# EAGLE design H01R0 (EAGLE 9.6.1)

## Sheet 1 of 2
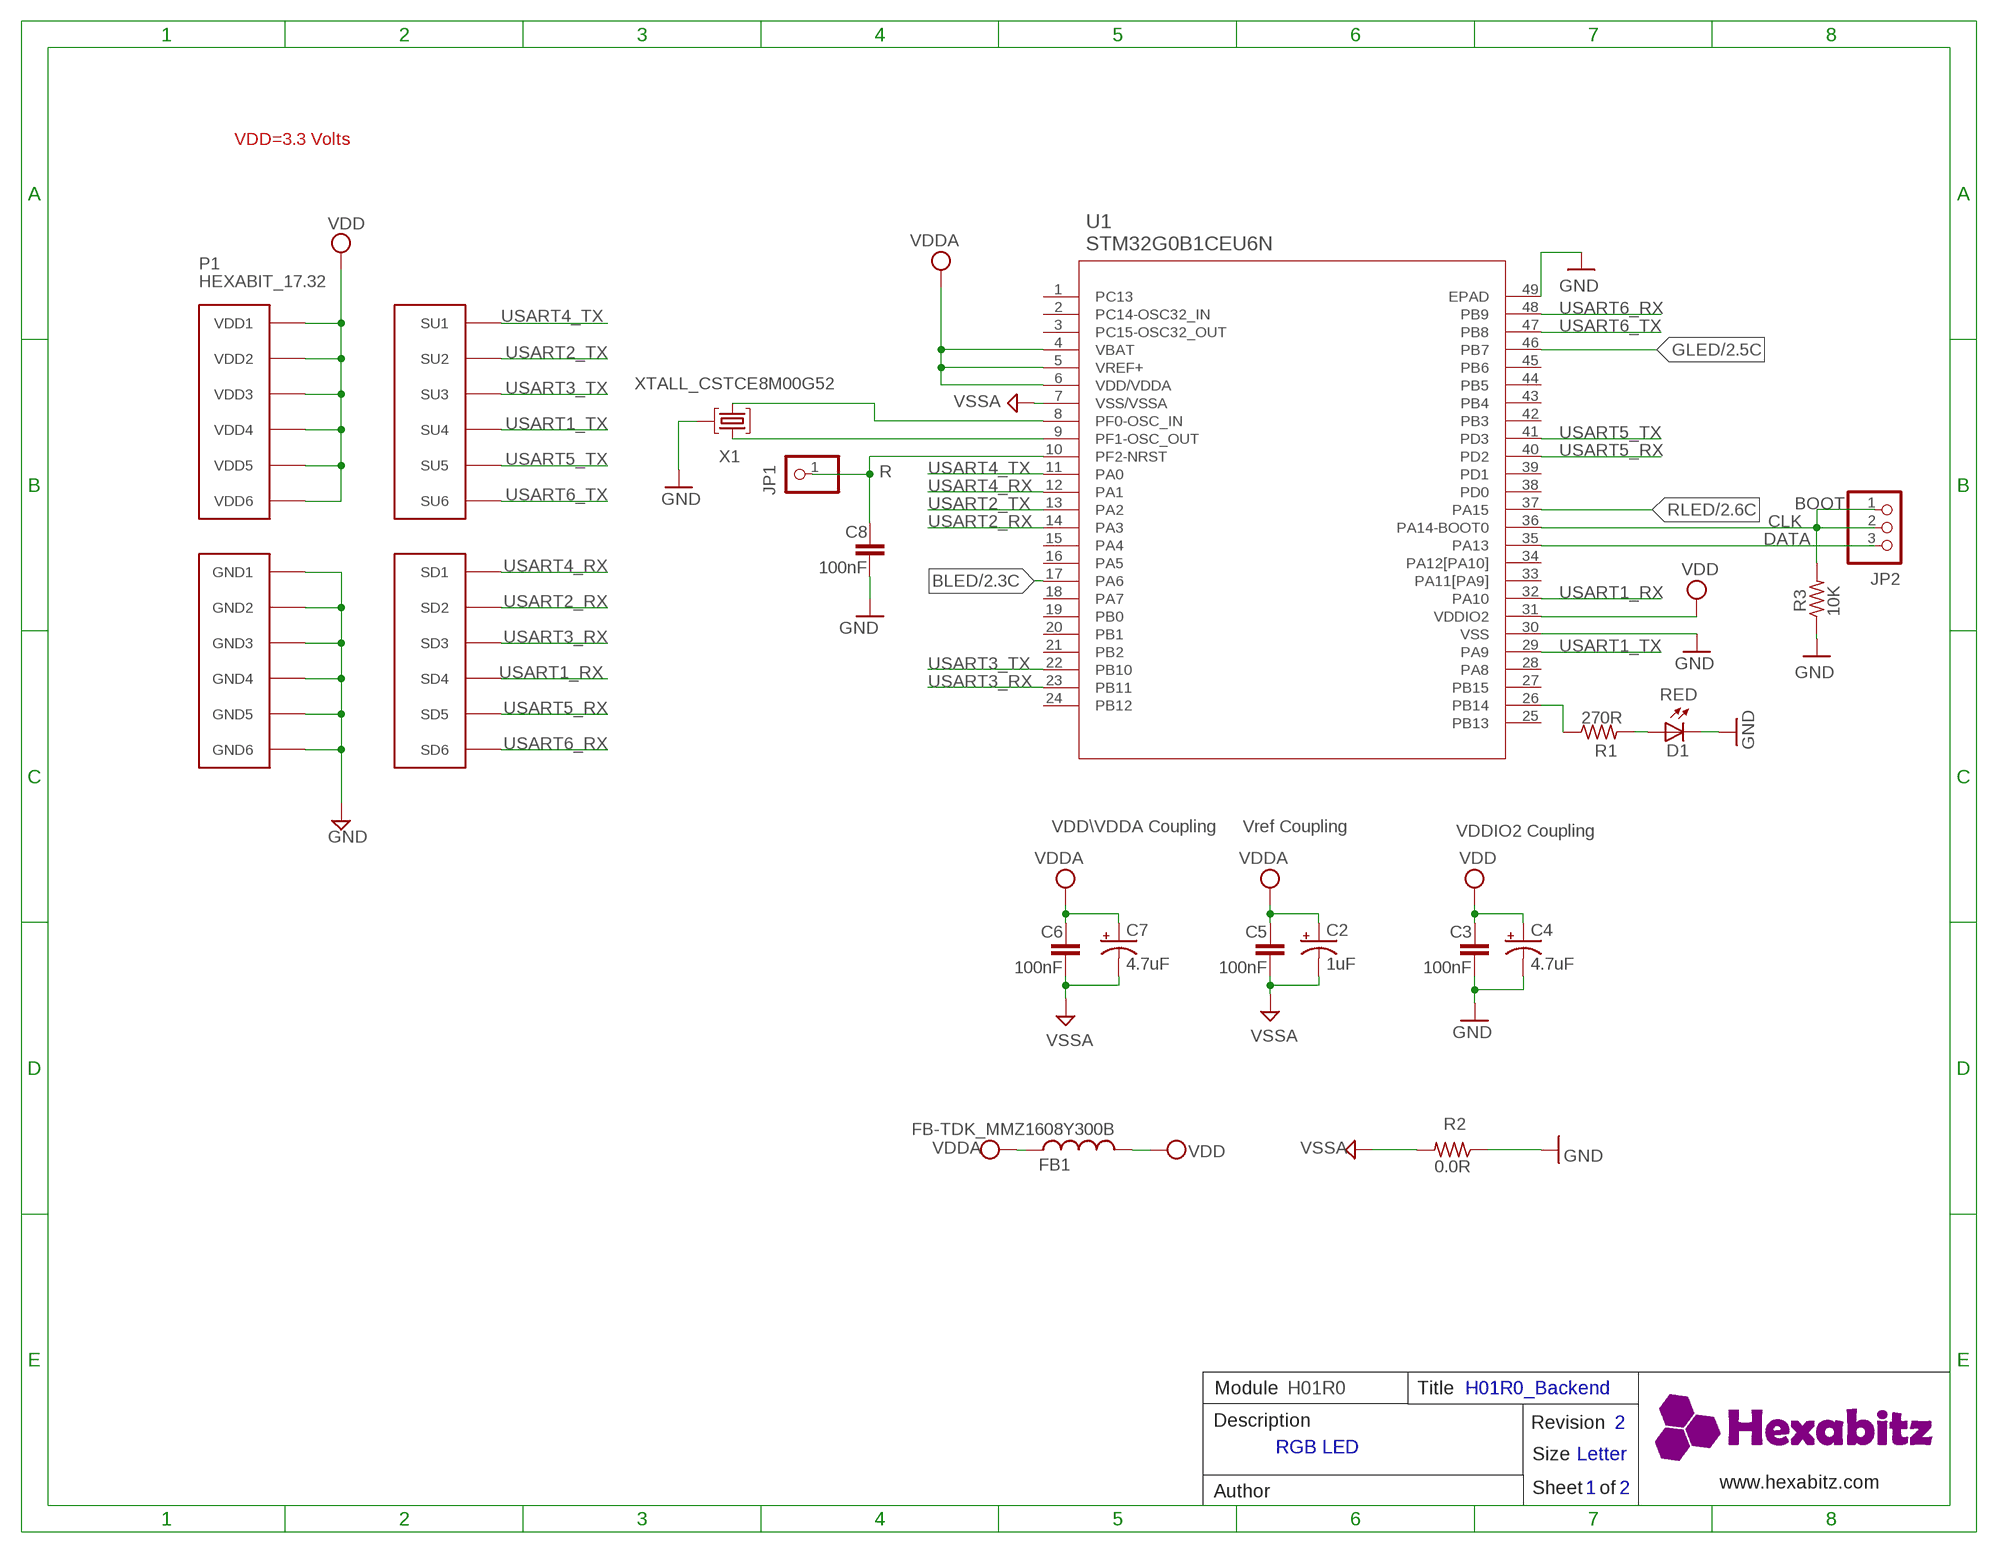
[diagram p0: schematic, sheet 1]

### Parts
C2  1uF  C-0805-POL  [C-0805-POL]
C3  100nF  C-0603  [C-0603]
C4  4.7uF  C-0805-POL  [C-0805-POL]
C5  100nF  C-0603  [C-0603]
C6  100nF  C-0603  [C-0603]
C7  4.7uF  C-0805-POL  [C-0805-POL]
C8  100nF  C-0603  [C-0603]
D1  RED  VLMS1300-GS08  [VLMS1300-GS08]
FB1  FB-TDK_MMZ1608Y300B  FB-0603  [FB-0603]
JP1  R  PINHD-1X1  [1X01]
JP2  PINHD-1X3  [1X03]
P1  HEXABIT_17.32  [HEXABIT_17.32]
R1  270R  R-0603  [R-0603]
R2  0.0R  R-0603  [R-0603]
R3  10K  R-0603  [R-0603]
U1  STM32G0B1CEU6N  [HEXABITZ_ICS_QFN_B1CEU6_STM-L]
X1  XTALL_CSTCE8M00G52  [XTALL_CSTCE8M00G52]

### Nets
BLED: U1.17(PA6) ; also sheet 2
CLK: JP2.1 JP2.2 R3.2 U1.36(PA14-BOOT0)
DATA: JP2.3 U1.35(PA13)
GLED: U1.46(PB7) ; also sheet 2
GND: C3.2 C4.2(-) C8.2 D1.C P1.PAD_PD7(GND1) P1.PAD_PD8(GND2) P1.PAD_PD9(GND3) P1.PAD_PD10(GND4) P1.PAD_PD11(GND5) P1.PAD_PD12(GND6) R2.1 R3.1 U1.30(VSS) U1.49(EPAD) X1.P$2 ; also sheet 2
N$3: D1.A R1.2
N$4: C8.1 JP1.1 U1.10(PF2-NRST)
N$5: U1.9(PF1-OSC_OUT) X1.P$1
N$6: U1.8(PF0-OSC_IN) X1.P$3
N$7: R1.1 U1.26(PB14)
RLED: U1.37(PA15) ; also sheet 2
USART1_RX: P1.PAD_PD4(SD4) U1.32(PA10)
USART1_TX: P1.PAD_PU4(SU4) U1.29(PA9)
USART2_RX: P1.PAD_PD2(SD2) U1.14(PA3)
USART2_TX: P1.PAD_PU2(SU2) U1.13(PA2)
USART3_RX: P1.PAD_PD3(SD3) U1.23(PB11)
USART3_TX: P1.PAD_PU3(SU3) U1.22(PB10)
USART4_RX: P1.PAD_PD1(SD1) U1.12(PA1)
USART4_TX: P1.PAD_PU1(SU1) U1.11(PA0)
USART5_RX: P1.PAD_PD5(SD5) U1.40(PD2)
USART5_TX: P1.PAD_PU5(SU5) U1.41(PD3)
USART6_RX: P1.PAD_PD6(SD6) U1.48(PB9)
USART6_TX: P1.PAD_PU6(SU6) U1.47(PB8)
VDD: C3.1 C4.1(+) FB1.2 P1.PAD_PU7(VDD1) P1.PAD_PU8(VDD2) P1.PAD_PU9(VDD3) P1.PAD_PU10(VDD4) P1.PAD_PU11(VDD5) P1.PAD_PU12(VDD6) U1.31(VDDIO2) ; also sheet 2
VDDA: C2.1(+) C5.1 C6.1 C7.1(+) FB1.1 U1.4(VBAT) U1.5(VREF+) U1.6(VDD/VDDA)
VSSA: C2.2(-) C5.2 C6.2 C7.2(-) R2.2 U1.7(VSS/VSSA)
Unconnected: U1.1(PC13) U1.2(PC14-OSC32_IN) U1.3(PC15-OSC32_OUT) U1.15(PA4) U1.16(PA5) U1.18(PA7) U1.19(PB0) U1.20(PB1) U1.21(PB2) U1.24(PB12) U1.25(PB13) U1.27(PB15) U1.28(PA8) U1.33(PA11[PA9]) U1.34(PA12[PA10]) U1.38(PD0) U1.39(PD1) U1.42(PB3) U1.43(PB4) U1.44(PB5) U1.45(PB6)

### Notes on the sheet
- VDD=3.3 Volts
- BOOT
- VDD\VDDA Coupling | Vref Coupling | VDDIO2 Coupling
- Module | H01R0 | Title | H01R0_Backend
- Description | Revision | 2
- RGB LED
- Size | Letter
- www.hexabitz.com
- Author | Sheet   of | 1 | 2
- C:/Users/Admin/Desktop/logodraft.bmp

## Sheet 2 of 2
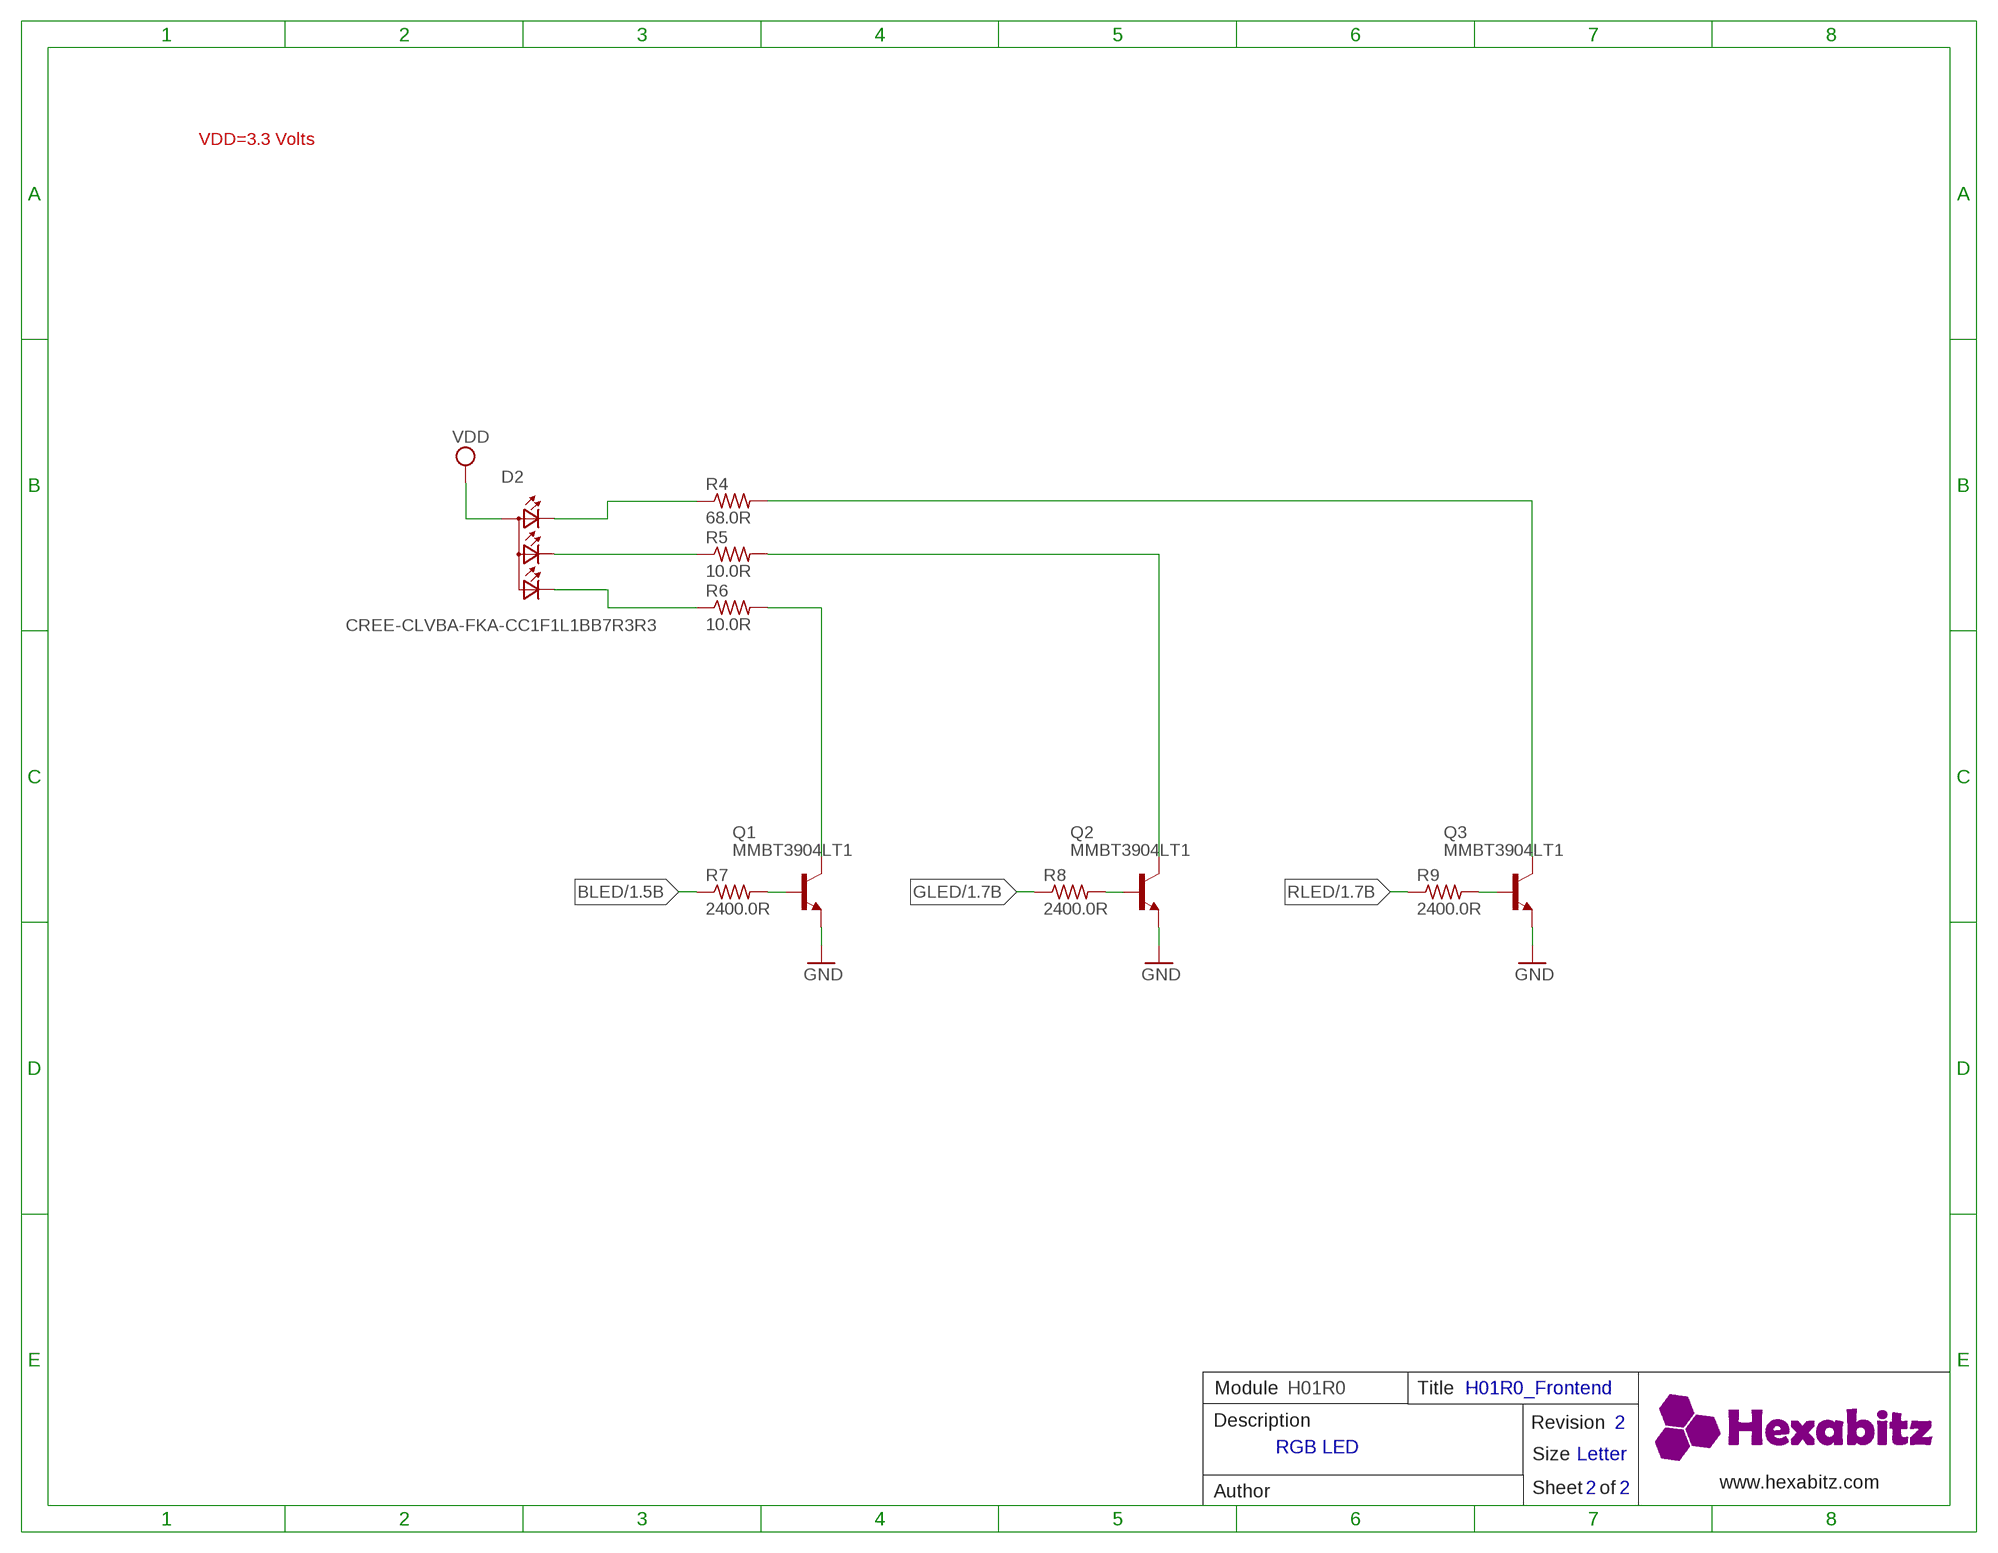
[diagram p1: schematic, sheet 2]

### Parts
D2  CREE-CLVBA-FKA-CC1F1L1BB7R3R3  [PCB-1023943-1]
Q1  MMBT3904LT1  [MMBT3904LT1]
Q2  MMBT3904LT1  [MMBT3904LT1]
Q3  MMBT3904LT1  [MMBT3904LT1]
R4  68.0R  R-0603  [R-0603]
R5  10.0R  R-0603  [R-0603]
R6  10.0R  R-0603  [R-0603]
R7  2400.0R  R-0603  [R-0603]
R8  2400.0R  R-0603  [R-0603]
R9  2400.0R  R-0603  [R-0603]

### Nets
BLED: R7.1 ; also sheet 1
GLED: R8.1 ; also sheet 1
GND: Q1.2(E) Q2.2(E) Q3.2(E) ; also sheet 1
N$1: D2.P$1(CRED) R4.1
N$2: D2.P$4(CGREEN) R5.1
N$8: D2.P$3(CBLUE) R6.1
N$10: Q1.3(C) R6.2
N$11: Q2.3(C) R5.2
N$12: Q3.3(C) R4.2
N$13: Q1.1(B) R7.2
N$14: Q2.1(B) R8.2
N$15: Q3.1(B) R9.2
RLED: R9.1 ; also sheet 1
VDD: D2.P$2(A2) ; also sheet 1

### Notes on the sheet
- VDD=3.3 Volts
- Module | H01R0 | Title | H01R0_Frontend
- Description | Revision | 2
- RGB LED
- Size | Letter
- www.hexabitz.com
- Author | Sheet   of | 2 | 2

## Library data of the parts
C2 C4 C7 = HEXABITZ_RCLS:C-0805-POL: Cap Tant Solid SMD 2012
C3 C5 C6 C8 = HEXABITZ_RCLS:C-0603: CAP CER 10% X7R 0603
D1 = Hexabitz:VLMS1300-GS08: Red 0603 130° Clear 54 mcd 2 V Surface Mount ChipLED ; Octopart Url : http://octopart.com/vlms1300-gs08-vishay-21709201; MFN: Vishay; MPN: VLMS1300-GS08; OCTOPART_URL: https://octopart.com/vlms1300-gs08-vishay-21709201?r=sp&s=_gcP4_q8T1SC6PJQPTQ9yA
D2 = Hexabitz:CREE-CLVBA-FKA-CC1F1L1BB7R3R3: CREE CLVBA-FKA-CC1F1L1BB7R3R3 LED, HB, RGB, SMD, 130mW; MFN: Cree, Inc.; MPN: CLVBA-FKA-CC1F1L1BB7R3R3; OCTOPART_URL: https://octopart.com/clvba-fka-cc1f1l1bb7r3r3-cree-20054005
FB1 = HEXABITZ_RCLS:FB-0603: Ferrite Beads Multi-Layer 0603; MFN: TDK; MPN: MMZ1608Y300B; OCTOPART_URL: https://octopart.com/mmz1608y300b-tdk-368280?r=sp&s=cd9_2ZEqQ9q9UNBuQgHAiA
JP1 = HEXABITZ_USER_INTERFACE_PARTS:PINHD-1X1: PIN HEADER; MFN: TE Connectivity; MPN: 87227-1; OCTOPART_URL: https://octopart.com/87227-1-te+connectivity-39512052?r=sp
JP2 = pinhead:PINHD-1X3: PIN HEADER
P1 = hexabitz_connectors:HEXABIT_?: Hexabitz Hexagon Module Connector Hexagon side length = 28.87mm.
Q1 = HEXABITZ_RCLS:MMBT3904LT1: TRANS NPN 40V 0.2A SOT23; MFN: ON Semiconductor; MOUNTING_STYLE: Surface Mount; MPN: MMBT3904LT1G; NUM_OF_PINS: 3; OCTOPART_ID: 0bb6c2bc2200d471; OCTOPART_URL: http://octopart.com/mmbt3904lt1g-on+semiconductor-3280; PACKAGE: SOT-23-3; PACKAGING: Reel; POLARITY: NPN; POWER_DISSIPATION: 0.225W; PRODUCT_CATEGORY: Transistors Bipolar-BJT; SERIES: MMBT3904L; VOLTAGE_RATING_DC: 40.0V
Q2 Q3 = HEXABITZ_RCLS:MMBT3904LT1: TRANS NPN 40V 0.2A SOT23; MOUNTING_STYLE: Surface Mount; NUM_OF_PINS: 3; OCTOPART_ID: 0bb6c2bc2200d471; OCTOPART_URL: http://octopart.com/mmbt3904lt1g-on+semiconductor-3280; PACKAGE: SOT-23-3; PACKAGING: Reel; POLARITY: NPN; POWER_DISSIPATION: 0.225W; PRODUCT_CATEGORY: Transistors Bipolar-BJT; SERIES: MMBT3904L; VOLTAGE_RATING_DC: 40.0V
R1 R3 = HEXABITZ_RCLS:R-0603: Thick Film Resistors - SMD 0603
R2 = HEXABITZ_RCLS:R-0603: Thick Film Resistors - SMD 0603; MFN: Yageo; MPN: RC0603JR-070RL; OCTOPART_URL: https://octopart.com/rc0603jr-070rl-yageo-1241539?r=sp&s=X2NteqRjRNWrnx42Y0aliA; RESISTANCE: 0.0 Ohm
R4 = HEXABITZ_RCLS:R-0603: Thick Film Resistors - SMD 0603; MFN: Vishay; MPN: CRCW060368R0FKEA; OCTOPART_URL: https://octopart.com/crcw060368r0fkea-vishay-39811903; RESISTANCE: 68.0 Ω; SPICEPREFIX: R; TOLERANCE: 1%
R5 R6 = HEXABITZ_RCLS:R-0603: Thick Film Resistors - SMD 0603; MFN: Vishay; MPN: CRCW060310R0FKEB; OCTOPART_URL: https://octopart.com/crcw060310r0fkeb-vishay-42507905; RESISTANCE: 10.0 Ω; TOLERANCE: 1%
R7-R9 = HEXABITZ_RCLS:R-0603: Thick Film Resistors - SMD 0603; MFN: Vishay; MPN: CRCW06032K40JNEA; OCTOPART_URL: https://octopart.com/crcw06032k40jnea-vishay-40298967; RESISTANCE: 2400.0 Ω; TOLERANCE: 5%
U1 = HEXABITZ_ICs:STM32G0B1CEU6N
X1 = Hexabitz:XTALL_CSTCE8M00G52: MURATA CSTCE8M00G52-R0 RESONATOR, SMD, 8MHZ ; Octopart Url : https://octopart.com/cstce8m00g52-r0-murata-7145559; MFN: Murata; MPN: CSTCE8M00G52Z-R0; OCTOPART_URL: https://octopart.com/cstce8m00g52z-r0-murata-17755941?r=sp&s=JDnNJnrHQhyS8Zk4ofFWXw

## Board
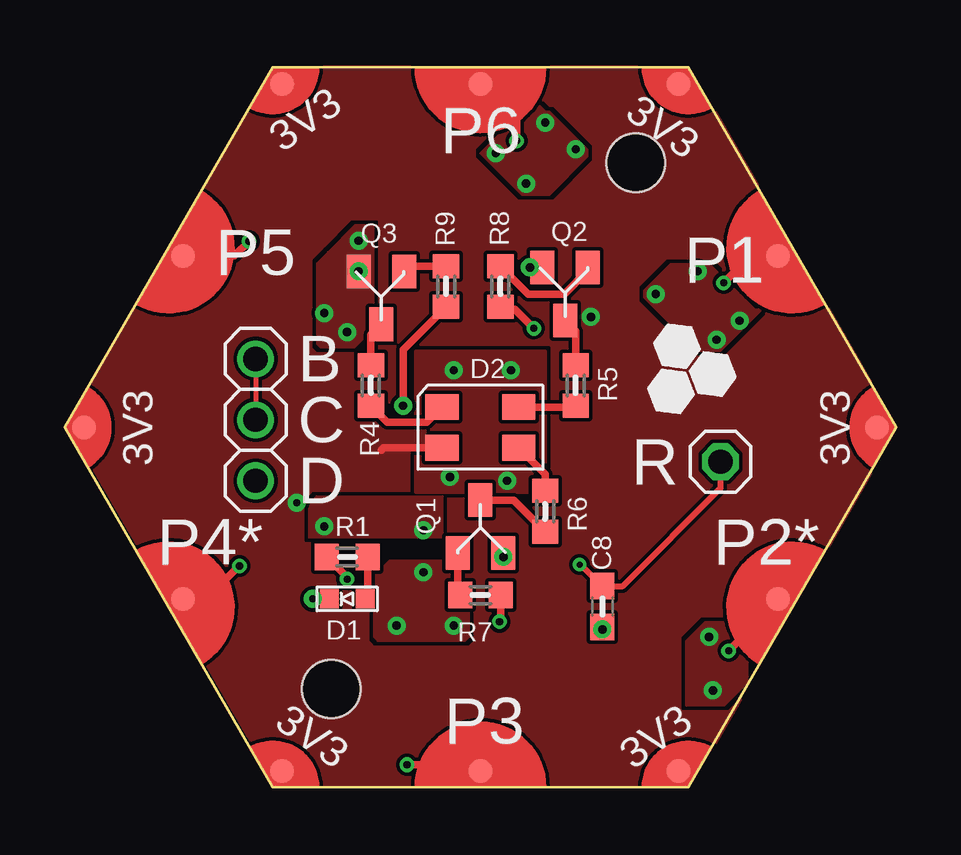
[diagram p2: board, top side]
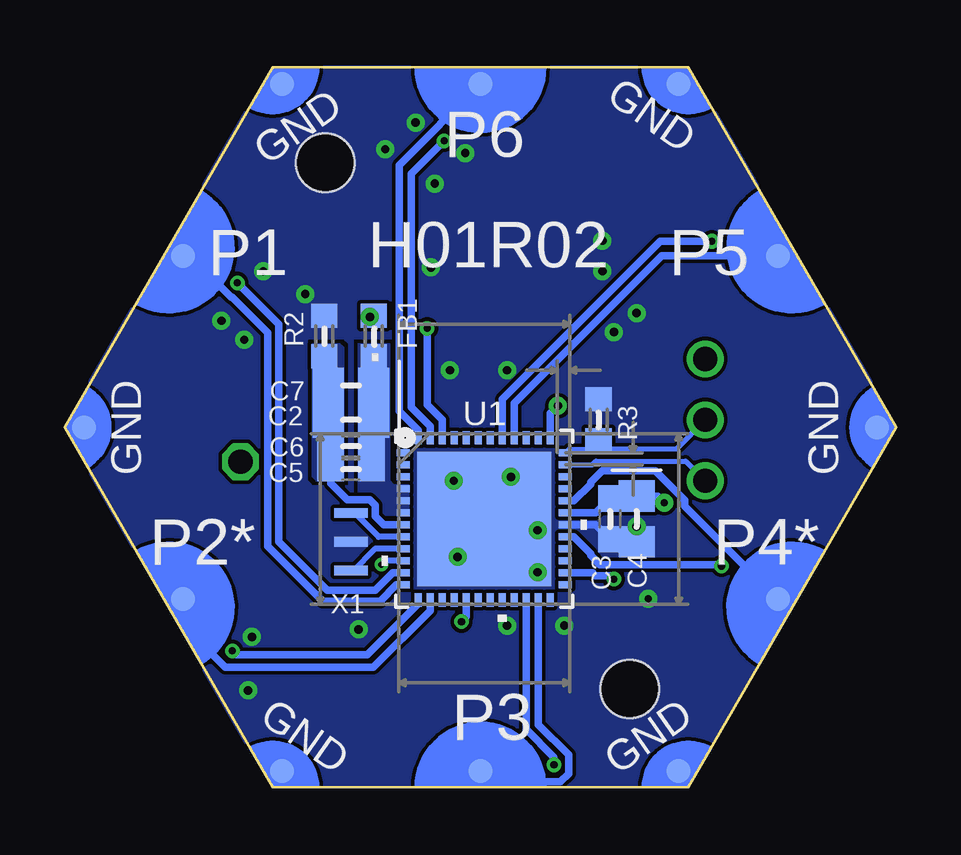
[diagram p3: board, bottom side, seen from below]

Size 34.64 x 30 mm. Coordinates in mm from the lower left corner, seen from the top.
Copper layers (1*16): Top 0.035mm / dielectric 1.5mm / Bottom 0.035mm
Design rules "Ibrahim *": minimum track width 6mil, minimum drill 0.2mm, track to track 6mil, track to pad 6mil, pad to pad 6mil, via to via 6mil, smd to smd 0mil, copper to edge 0mil, drill to drill 6mil, minimum pad ring 10mil, minimum via ring 6mil, stop-mask expansion 4mil, vias tented up to drill 24mil, thermal gap 10mil
Holes 2.44 mm at 11.11,4.1 23.79,26.02

### Footprints (pad centres in the part's own frame; a part is rotated, then mirrored left to right if it is on the bottom)
C-0805-POL = smd 1.3 x 1.5: 1 -0.95,0; 2 0.95,0
C-0603 = smd 1.1 x 1: 1 -0.85,0; 2 0.85,0
VLMS1300-GS08 = smd 0.8 x 0.8: A 0,0.75; C 0,-0.75
PCB-1023943-1 = smd 1.378 x 1.08: P$1 -1.604,0.85; P$2 -1.604,-0.85; P$3 1.604,-0.85; P$4 1.604,0.85
FB-0603 = smd 1 x 1.1: 1 -0.85,0; 2 0.85,0
1X01 = drill 1.016 octagon: 1 0,0
1X03 = drill 1.016: 1 -2.54,0; 2 0,0; 3 2.54,0
HEXABIT_17.32 = smd 1 x 1 bottom: PAD_PD1 12.39,7.15; PAD_PD2 12.39,-7.15; PAD_PD3 0,-14.31; PAD_PD4 -12.39,-7.15; PAD_PD5 -12.39,7.15; PAD_PD6 0,14.31; PAD_PD7 8.26,14.31; PAD_PD8 16.52,0; PAD_PD9 8.26,-14.31; PAD_PD10 -8.26,-14.31; PAD_PD11 -16.52,0; PAD_PD12 -8.26,14.31 | smd 1 x 1: PAD_PU1 12.39,7.15; PAD_PU2 12.39,-7.15; PAD_PU3 0,-14.31; PAD_PU4 -12.39,-7.15; PAD_PU5 -12.39,7.15; PAD_PU6 0,14.31; PAD_PU7 8.26,14.31; PAD_PU8 16.52,0; PAD_PU9 8.26,-14.31; PAD_PU10 -8.26,-14.31; PAD_PU11 -16.52,0; PAD_PU12 -8.26,14.31
MMBT3904LT1 = smd 1 x 1.4: 1 -0.95,-1.1; 2 0.95,-1.1; 3 0,1.1
R-0603 = smd 1 x 1.1: 1 -0.85,0; 2 0.85,0
HEXABITZ_ICS_QFN_B1CEU6_STM-L = smd 0.55 x 0.297: 1 -3.38,2.751; 2 -3.38,2.251; 3 -3.38,1.75; 4 -3.38,1.25; 5 -3.38,0.75; 6 -3.38,0.25; 7 -3.38,-0.25; 8 -3.38,-0.75; 9 -3.38,-1.25; 10 -3.38,-1.75; 11 -3.38,-2.251; 12 -3.38,-2.751; 25 3.38,-2.751; 26 3.38,-2.251; 27 3.38,-1.75; 28 3.38,-1.25; 29 3.38,-0.75; 30 3.38,-0.25; 31 3.38,0.25; 32 3.38,0.75; 33 3.38,1.25; 34 3.38,1.75; 35 3.38,2.251; 36 3.38,2.751 | smd 0.297 x 0.55: 13 -2.751,-3.38; 14 -2.251,-3.38; 15 -1.75,-3.38; 16 -1.25,-3.38; 17 -0.75,-3.38; 18 -0.25,-3.38; 19 0.25,-3.38; 20 0.75,-3.38; 21 1.25,-3.38; 22 1.75,-3.38; 23 2.251,-3.38; 24 2.751,-3.38; 37 2.751,3.38; 38 2.251,3.38; 39 1.75,3.38; 40 1.25,3.38; 41 0.75,3.38; 42 0.25,3.38; 43 -0.25,3.38; 44 -0.75,3.38; 45 -1.25,3.38; 46 -1.75,3.38; 47 -2.251,3.38; 48 -2.751,3.38 | smd 5.6 x 5.6: 49 0,0
XTALL_CSTCE8M00G52 = smd 1.4 x 0.4: P$1 0,1.2; P$2 0,0; P$3 0,-1.2

### Placement (x,y rotation side)
C2  22.72,15.32 180 bottom
C3  11.92,11.19 270 bottom
C4  10.81,11.19 270 bottom
C5  22.72,13.25 180 bottom
C6  22.72,14.21 180 bottom
C7  22.72,16.75 180 bottom
C8  22.4,7.54 270 top
D1  11.76,7.86 270 top
D2  17.32,15 0 top
FB1  21.77,18.81 90 bottom
JP1  27.32,13.57 0 top
JP2  7.95,15.32 270 top
P1  17.32,15 0 top
Q1  17.32,10.87 0 top
Q2  20.85,20.56 180 top
Q3  13.19,20.4 180 top
R1  11.76,9.6 0 top
R2  23.83,18.81 270 bottom
R3  12.4,15.32 270 bottom
R4  12.75,16.75 90 top
R5  21.29,16.75 90 top
R6  20.02,11.51 270 top
R7  17.32,8.02 180 top
R8  18.15,20.87 90 top
R9  15.89,20.87 90 top
U1  17.16,11.19 0 bottom
X1  22.72,10.24 180 bottom

### Tracks (layer width: path | path; a pad name or v marks a point on that pad's centre or on a via)
BLED  (via drill 0.3 pad 0.6)
  Top 0.305: R7.1 18.17,6.96 v18.11,6.9
  Bottom 0.305: v18.11,6.9 17.91,7.11 U1.17
CLK
  Top 0.203: JP2.1 JP2.2
  Bottom 0.203: JP2.2 9.17,14.1 12.4,14.1 | U1.36 13.62,14.1 12.4,14.1 | R3.2 12.4,14.1
DATA
  Bottom 0.203: U1.35 12.67,13.44 12.51,13.6 8.78,13.6 JP2.3
GLED  (via drill 0.3 pad 0.6)
  Top 0.305: R8.1 18.25,19.92 18.75,19.92 v19.54,19.13
  Bottom 0.305: U1.46 18.91,15.32 19.54,15.95 v19.54,19.13
GND  (via drill 0.3 pad 0.75, 0.35 pad 0.75)
  Top 0.305: Q2.2 19.39,21.66 v19.38,21.67 | C8.2 v22.4,6.59 | D1.C v10.34,7.86 | Q1.2 v18.27,9.6
  Bottom 0.305: U1.30 12.52,10.94 C3.2 10.91,10.34 C4.2
  other vias: 27.16,18.65 28.12,19.45 26.37,21.51 24.62,20.56 20.02,27.7 21.29,26.59 19.23,25.16 17.96,26.43 12.24,21.51 26.84,6.27 27,4.05 16.21,6.75 13.83,6.75 14.94,8.97 16.21,17.38 18.59,17.38 16.05,12.94 18.43,12.78 12.24,22.78 11.76,18.97 10.81,19.76 14.94,10.71 10.81,10.87
  pour Bottom (rank 2, no thermals): 8.69,0.03 26.04,0.03 34.69,15.01 26.03,30.01 8.63,30.01 0,15.07
  pour Top (no thermals): 29.07,19.92 27.32,18.18 26.37,18.18 24.15,20.4 24.15,20.71 24.46,21.03 25.26,21.83 26.84,21.83 28.75,19.92
  pour Top (no thermals): 19.7,28.49 20.02,28.18 20.18,28.18 21.77,26.59 21.77,26.27 20.18,24.68 19.07,24.68 17.32,26.43 19.38,28.49
  pour Top (no thermals): 27.48,6.9 28.43,5.95 28.43,4.36 27.48,3.41 25.89,3.41 25.89,6.11 26.69,6.9
  pour Top (no thermals): 15.57,9.44 13.51,9.44 12.88,8.81 12.88,6.27 13.03,6.11 16.68,6.11 16.84,6.27 16.84,8.81 16.21,9.44
  pour Top (no thermals): 20.02,12.3 14.62,12.3 14.62,18.18 20.02,18.18
  pour Top (no thermals): 12.08,18.33 12.88,19.13 12.88,23.41 12.08,23.41 10.97,22.3 10.49,21.83 10.49,18.49 10.65,18.33
  pour Top (no thermals): 15.73,12.14 15.73,10.4 10.18,10.4 10.18,11.83 10.49,12.14
N$1
  Top 0.305: D2.P$1 15.08,15.21 13.43,15.21 R4.1
N$2
  Top 0.305: R5.1 21.24,15.85 D2.P$4
N$3
  Top 0.305: R1.2 12.61,7.96 D1.A
N$4  (via drill 0.25 pad 0.55)
  Top 0.254: v21.45,9.28 21.5,9.28 C8.1 23.25,8.39 27.32,12.46 JP1.1
  Bottom 0.254: U1.10 21.29,9.44 v21.45,9.28
N$5
  Bottom 0.254: X1.P$1 22.62,9.04 21.72,9.94 U1.9
N$6
  Bottom 0.254: X1.P$3 22.56,11.44 21.56,10.44 U1.8
N$7  (via drill 0.3 pad 0.6)
  Top 0.305: R1.1 11.76,8.75 v11.76,8.68
  Bottom 0.305: v11.76,8.68 11.91,8.83 12.54,8.83 12.65,8.94 U1.26
N$8
  Top 0.305: D2.P$3 20.02,13.06 R6.1
N$10
  Top 0.305: R6.2 18.7,11.97 Q1.3
N$11
  Top 0.305: Q2.3 21.29,19.01 R5.2
N$12
  Top 0.305: R4.2 12.75,18.86 Q3.3
N$13
  Top 0.305: Q1.1 16.37,8.11 R7.2
N$14
  Top 0.305: R8.2 19.32,20.56 20.81,20.56 21.8,21.54 Q2.1
N$15
  Top 0.305: Q3.1 14.37,21.72 R9.2
RLED  (via drill 0.35 pad 0.75)
  Top 0.305: R9.1 14.09,18.23 v14.09,15.9
  Bottom 0.305: v14.09,15.9 14.41,15.59 U1.37
USART1_RX
  Bottom 0.305: U1.32 13.43,11.94 12.73,12.64 12.73,12.72 12.25,13.19 10.03,13.19 8.8,11.96 8.8,11.72 P1.PAD_PD4
USART1_TX  (via drill 0.3 pad 0.6)
  Top 0.305: v7.28,9.23 5.9,7.85 P1.PAD_PU4
  Bottom 0.305: U1.29 13.43,10.44 12.73,9.74 12.73,9.66 12.35,9.29 7.34,9.29 v7.28,9.23
USART2_RX
  Bottom 0.305: U1.14 19.41,7.37 21.78,5 27.96,5 29.56,6.6 29.71,6.87 P1.PAD_PD2
USART2_TX  (via drill 0.3 pad 0.6)
  Top 0.305: v27.66,5.69 29.71,7.74 P1.PAD_PU2
  Bottom 0.305: U1.13 19.91,7.65 22.03,5.53 27.5,5.53 v27.66,5.69
USART3_RX
  Bottom 0.305: U1.23 14.91,2.62 13.65,1.36 13.65,0.57 13.99,0.24 16.87,0.24 P1.PAD_PD3
USART3_TX  (via drill 0.3 pad 0.6)
  Top 0.305: v14.26,0.95 17.07,0.95 P1.PAD_PU3
  Bottom 0.305: U1.22 15.41,2.42 14.26,1.26 v14.26,0.95
USART4_RX
  Bottom 0.305: P1.PAD_PD1 29.44,22.15 27.7,20.41 27.66,20.41 26.19,18.95 26.19,10.06 23.89,7.76 21.5,7.76 20.82,8.44 U1.12
USART4_TX  (via drill 0.3 pad 0.6)
  Top 0.305: v27.45,21.02 28.58,22.15 P1.PAD_PU1
  Bottom 0.305: U1.11 20.97,8.94 21.69,8.22 23.7,8.22 25.73,10.25 25.73,19.3 v27.45,21.02
USART5_RX
  Bottom 0.305: U1.40 15.91,16 9.76,22.15 P1.PAD_PD5
USART5_TX  (via drill 0.3 pad 0.6)
  Top 0.305: v7.68,22.76 7.07,22.15 P1.PAD_PU5
  Bottom 0.305: v7.68,22.76 9.84,22.76 16.41,16.18 U1.41
USART6_RX
  Bottom 0.305: U1.48 19.91,14.89 20.71,15.68 20.71,25.92 P1.PAD_PD6
USART6_TX  (via drill 0.3 pad 0.6)
  Top 0.305: v18.83,26.94 18.83,27.8 P1.PAD_PU6
  Bottom 0.305: U1.47 19.41,15.05 20.21,15.84 20.21,25.57 v18.83,26.94
VDD  (via drill 0.3 pad 0.75, 0.35 pad 0.75)
  Top 0.305: D2.P$2 13.29,14.15 13.19,14.05
  Bottom 0.305: U1.31 12.52,11.44 C3.1 10.91,12.04 C4.1 9.94,12.14 v9.66,11.86 | FB1.2 21.87,19.66 v21.92,19.6
  pour Top (rank 2, no thermals): 8.87,0.03 26.06,0.03 34.66,15 26.02,30.04 8.7,30.01 0.13,15.17
VDDA
  pour Bottom (no thermals): 20.34,11.35 21.77,11.35 22.4,11.98 22.4,18.49 21.13,18.49 21.13,12.78 20.97,12.62 20.34,12.62
VSSA
  Bottom 0.305: U1.7 21.36,10.94 21.71,11.3 21.71,11.76 21.93,11.98 22.88,11.98 23.57,12.68 C5.2
  pour Bottom (no thermals): 24.15,12.78 24.3,12.94 24.3,18.49 23.19,18.49 23.04,18.33 23.04,12.78

### Text on the board
tPlace: 3V3 | P6 | 3V3 | P5 | P1 | 3V3 | 3V3 | P4* | P2* | P3 | 3V3 | 3V3
bPlace: GND | P6 | GND | H01R02 | P5 | P1 | GND | GND | P4* | P2* | P3 | GND | GND
tNames: B | C | R | D
bNames: .